# EAGLE schematic Plinto-Rev_02 (EAGLE 6.5.0)
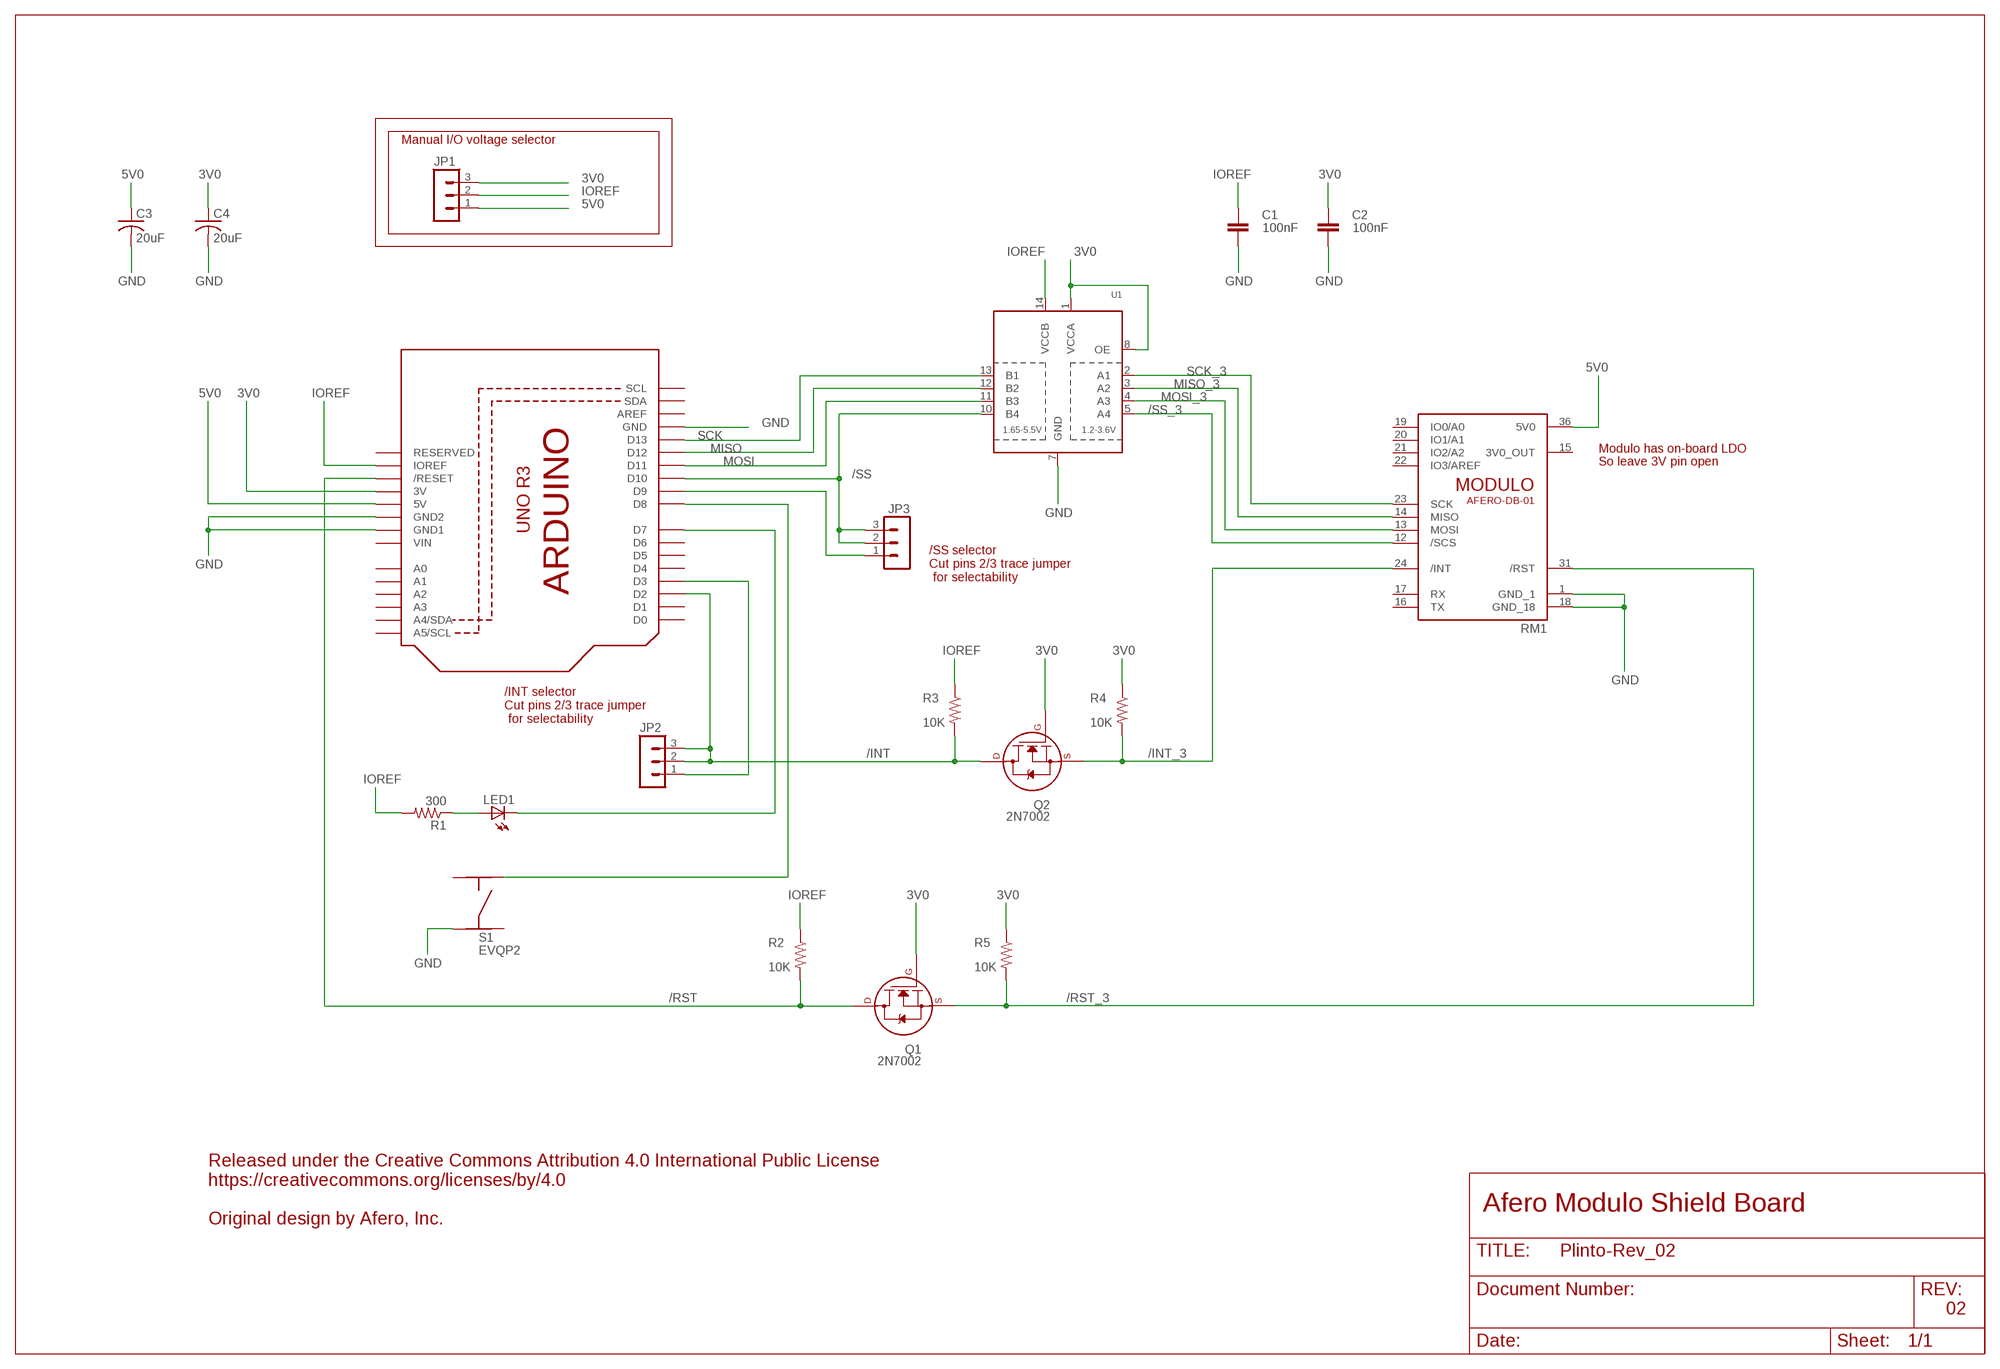
[diagram p0: schematic, sheet 1]

## Parts
C1  100nF  C-EUC0402  [C0402]
C2  100nF  C-EUC0402  [C0402]
C3  20uF  C-USC0805  [C0805]
C4  20uF  C-USC0805  [C0805]
JP1  3PIN_JMPR  [3PIN_JMPR]
JP2  3PIN_JMPR  [3PIN_JMPR]
JP3  3PIN_JMPR  [3PIN_JMPR]
LED1  LEDCHIPLED_0603  [CHIPLED_0603]
Q1  2N7002  2N7002_SOT23  [SOT-23]
Q2  2N7002  2N7002_SOT23  [SOT-23]
R1  300  R-US_R0402  [R0402]
R2  10K  R-US_R0402  [R0402]
R3  10K  R-US_R0402  [R0402]
R4  10K  R-US_R0402  [R0402]
R5  10K  R-US_R0402  [R0402]
RM1  MODULOAFERO-DB-01  [MODULO]
S1  EVQP2  [EVQP2]
U1  TXB0104PWR  [TSSOP14]
U$1  ARDUINO_UNO_R3KIBANVERSION  [ARDUINO_R3]

## Nets
3V0: C2.1 C4.1 JP1.3 Q1.1(G) Q2.1(G) R4.1 R5.1 U1.1(VCCA) U1.8(OE) U$1.3V
5V0: C3.1 JP1.1 RM1.36(5V0) U$1.5V
/INT: JP2.2 JP2.3 Q2.3(D) R3.2 U$1.D2
/INT_3: Q2.2(S) R4.2 RM1.24(/INT)
/RST: Q1.3(D) R2.2 U$1.RESET(/RESET)
/RST_3: Q1.2(S) R5.2 RM1.31(/RST)
/SS: JP3.2 JP3.3 U1.10(B4) U$1.D10
/SS_3: RM1.12(/SCS) U1.5(A4)
GND: C1.2 C2.2 C3.2 C4.2 RM1.1(GND_1) RM1.18(GND_18) S1.P$4 U1.7(GND) U$1.GND U$1.GND1 U$1.GND2
IOREF: C1.1 JP1.2 R1.2 R2.1 R3.1 U1.14(VCCB) U$1.IOREF
MISO: U1.12(B2) U$1.D12
MISO_3: RM1.14(MISO) U1.3(A2)
MOSI: U1.11(B3) U$1.D11
MOSI_3: RM1.13(MOSI) U1.4(A3)
N$1: LED1.A R1.1
N$3: LED1.C U$1.D7
N$4: JP2.1 U$1.D3
N$5: S1.P$1 U$1.D8
N$48: JP3.1 U$1.D9
SCK: U1.13(B1) U$1.D13
SCK_3: RM1.23(SCK) U1.2(A1)
Unconnected: RM1.16(TX) RM1.17(RX) RM1.19(IO0/A0) RM1.20(IO1/A1) RM1.21(IO2/A2) RM1.22(IO3/AREF) S1.P$2 S1.P$3 U$1.A0 U$1.A1 U$1.A2 U$1.A3 U$1.A4(A4/SDA) U$1.A5(A5/SCL) U$1.AREF U$1.D0 U$1.D1 U$1.D4 U$1.D5 U$1.D6 U$1.RESERVED U$1.SCL U$1.SDA

## Notes on the sheet
- Manual I/O voltage selector
- Modulo has on-board LDO
- So leave 3V pin open
- /SS selector
  Cut pins 2/3 trace jumper
   for selectability
- /INT selector
  Cut pins 2/3 trace jumper
   for selectability
- Afero Modulo Shield Board
- Released under the Creative Commons Attribution 4.0 International Public License
  https://creativecommons.org/licenses/by/4.0
  
  Original design by Afero, Inc.
- 02

## Power pins joined to a net without a drawn wire
3V0_OUT: RM1.15(3V0_OUT)
VIN: U$1.VIN

## Library data of the parts
C1 C2 = resistor:C-EU: CAPACITOR, European symbol; DESC: 100nF X7R, +/-10%; DKPN: 490-4759-1-ND
C3 C4 = rcl:C-US: CAPACITOR, American symbol
JP1-JP3 = Kiban_Libs:3PIN_JMPR
LED1 = adafruit:LED: LED OSRAM: - CHIPLED LG R971, LG N971, LY N971, LG Q971, LY Q971, LO R971, LY R971 LH N974, LH R974 LS Q976, LO Q976, LY Q976 LO Q996 - Hyper CHIPLED LW Q18S LB Q993, LB Q99A, LB R99A - SideLED LS A670, LO A670, LY A670, LG A670, LP A670 LB A673, LV A673, LT A673, LW A673 LH A674 LY A675 LS A676, LA A676, LO A676, LY A676, LW A676 LS A679, LY A679, LG A679 - Hyper Micro SIDELED® LS Y876, LA Y876, LO Y876, LY Y876 LT Y87S - SmartLED LW L88C, LW L88S LB L89C, LB L89S, LG L890 LS L89K, LO L89K, LY L89K LS L896, LA L896, LO L896, LY L896 - TOPLED LS T670, LO T670, LY T670, LG T670, LP T670 LSG T670, LSP T670, LSY T670, LOP T670, LYG T670 LG T671, LOG T671, LSG T671 LB T673, LV T673, LT T673, LW T673 LH T674 LS T676, LA T676, LO T676, LY T676, LB T676, LH T676, LSB T676, LW T676 LB T67C, LV T67C, LT T67C, LS T67K, LO T67K, LY T67K, LW E67C LS E67B, LA E67B, LO E67B, LY E67B, LB E67C, LV E67C, LT E67C LW T67C LS T679, LY T679, LG T679 LS T770, LO T770, LY T770, LG T770, LP T770 LB T773, LV T773, LT T773, LW T773 LH T774 LS E675, LA E675, LY E675, LS T675 LS T776, LA T776, LO T776, LY T776, LB T776 LHGB T686 LT T68C, LB T68C - Hyper Mini TOPLED® LB M676 - Mini TOPLED Santana® LG M470 LS M47K, LO M47K, LY M47K Source: http://www.osram.convergy.de/
Q1 Q2 = transistors:2N700*: 2N7000, 2N7002, NDS7002A N-channel enhancement mode MOSFET
R1-R5 = adafruit:R-US_: RESISTOR, American symbol
RM1 = AferoLib:MODULO
S1 = Kiban_Libs:EVQP2
U1 = adafruit:TXB0104PWR: 4-Bit Bi-Directional Level Shifter 1.2V-3.6V (VCCA) to 1.65V-5.5V (VCCB) bi-directional level shifter with auto direction sensing. Max data rate - VCCA 1.8V: 20Mbps (50ns), VCCA 3.3V: 100Mbps (10ns) Digikey: 296-21929-1-ND
U$1 = Kiban_Libs:ARDUINO_UNO_R3